# EAGLE design dual_encoder_shield_3v (EAGLE 9.6.2)
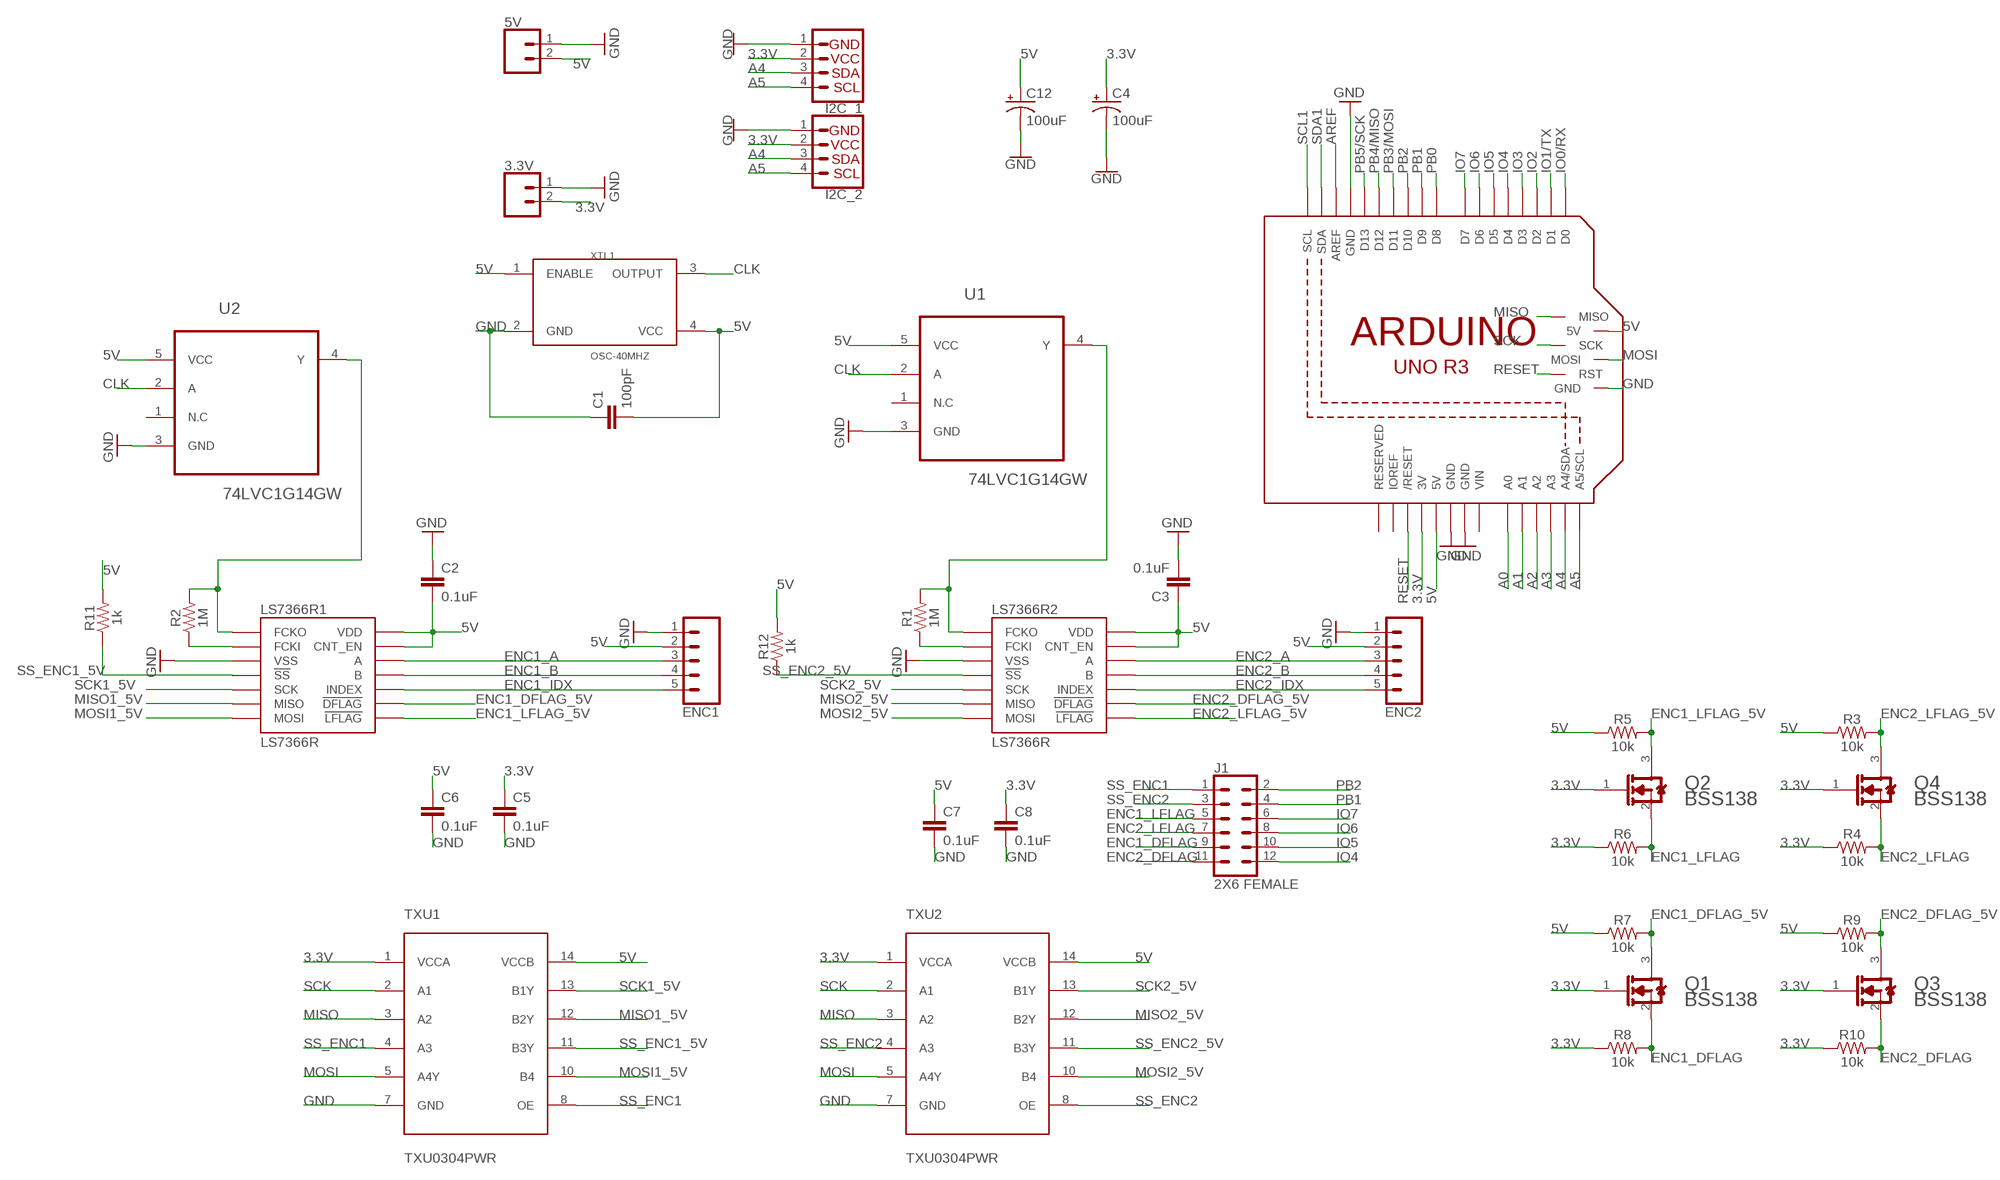
[diagram p0: schematic, sheet 1]

## Parts
3.3V  CONN_02-JST-2MM-SMT  [JST-2-SMD]
5V  CONN_02-JST-2MM-SMT  [JST-2-SMD]
C1  100pF  100PF-0603-50V-5%  [0603]
C2  0.1uF  0.1UF-0603-25V-5%  [0603]
C3  0.1uF  0.1UF-0603-25V-5%  [0603]
C4  100uF  100UF-POLAR-25V-20%(ELEC)  [PANASONIC_D]
C5  0.1uF  0.1UF-0603-25V-5%  [0603]
C6  0.1uF  0.1UF-0603-25V-5%  [0603]
C7  0.1uF  0.1UF-0603-25V-5%  [0603]
C8  0.1uF  0.1UF-0603-25V-5%  [0603]
C12  100uF  100UF-POLAR-25V-20%(ELEC)  [PANASONIC_D]
ENC1  CONN_05  [1X05]
ENC2  CONN_05  [1X05]
I2C_1  QWIIC_CONNECTORJS-1MM  [JST04_1MM_RA]
I2C_2  QWIIC_CONNECTORJS-1MM  [JST04_1MM_RA]
J1  2X6 FEMALE  CONN_06X2PTH_FEMALE  [2X6]
LS7366R1  LS7366R  [SOIC14]
LS7366R2  LS7366R  [SOIC14]
M1  ARDUINO_R3_ICSP  [ARDUINOR3_ICSP]
Q1  ON_SEMI_BSS138ON_SEMI_BSS138_0_0  [ON_SEMI_BSS138_0]
Q2  ON_SEMI_BSS138ON_SEMI_BSS138_0_0  [ON_SEMI_BSS138_0]
Q3  ON_SEMI_BSS138ON_SEMI_BSS138_0_0  [ON_SEMI_BSS138_0]
Q4  ON_SEMI_BSS138ON_SEMI_BSS138_0_0  [ON_SEMI_BSS138_0]
R1  1M  1MOHM-0603-1/4W-5%  [0603]
R2  1M  1MOHM-0603-1/4W-5%  [0603]
R3  10k  10KOHM-0603-1/10W-1%  [0603]
R4  10k  10KOHM-0603-1/10W-1%  [0603]
R5  10k  10KOHM-0603-1/10W-1%  [0603]
R6  10k  10KOHM-0603-1/10W-1%  [0603]
R7  10k  10KOHM-0603-1/10W-1%  [0603]
R8  10k  10KOHM-0603-1/10W-1%  [0603]
R9  10k  10KOHM-0603-1/10W-1%  [0603]
R10  10k  10KOHM-0603-1/10W-1%  [0603]
R11  1k  1KOHM-0603-1/10W-1%  [0603]
R12  1k  1KOHM-0603-1/10W-1%  [0603]
TXU1  TXU0304PWR  [SOP65P640X95-14N]
TXU2  TXU0304PWR  [SOP65P640X95-14N]
U1  74LVC1G14GW  [SOT65P210X110-5N]
U2  74LVC1G14GW  [SOT65P210X110-5N]
XTL1  OSC-40MHZ  [OSC_CB3LV-5I-50M000000]

## Nets
3.3V: 3.3V.2 C4.+ C5.1 C8.1 I2C_1.2 I2C_2.2 M1.3V Q1.1(G) Q2.1(G) Q3.1(G) Q4.1(G) R4.1 R6.1 R8.1 R10.1 TXU1.1(VCCA) TXU2.1(VCCA)
5V: 5V.2 C1.2 C2.2 C3.1 C6.1 C7.1 C12.+ ENC1.2 ENC2.2 LS7366R1.13(CNT_EN) LS7366R1.14(VDD) LS7366R2.13(CNT_EN) LS7366R2.14(VDD) M1.5V M1.5V_ICSP(5V) R3.1 R5.1 R7.1 R9.1 R11.2 R12.2 TXU1.14(VCCB) TXU2.14(VCCB) U1.5(VCC) U2.5(VCC) XTL1.1(ENABLE) XTL1.4(VCC)
A0: M1.A0
A1: M1.A1
A2: M1.A2
A3: M1.A3
A4: I2C_1.3 I2C_2.3 M1.A4(A4/SDA)
A5: I2C_1.4 I2C_2.4 M1.A5(A5/SCL)
AREF: M1.AREF
CLK: U1.2(A) U2.2(A) XTL1.3(OUTPUT)
ENC1_A: ENC1.3 LS7366R1.12(A)
ENC1_B: ENC1.4 LS7366R1.11(B)
ENC1_DFLAG: J1.9 Q1.2(S) R8.2
ENC1_DFLAG_5V: LS7366R1.9(!DFLAG) Q1.3(D) R7.2
ENC1_IDX: ENC1.5 LS7366R1.10(INDEX)
ENC1_LFLAG: J1.5 Q2.2(S) R6.2
ENC1_LFLAG_5V: LS7366R1.8(!LFLAG) Q2.3(D) R5.2
ENC2_A: ENC2.3 LS7366R2.12(A)
ENC2_B: ENC2.4 LS7366R2.11(B)
ENC2_DFLAG: J1.11 Q3.2(S) R10.2
ENC2_DFLAG_5V: LS7366R2.9(!DFLAG) Q3.3(D) R9.2
ENC2_IDX: ENC2.5 LS7366R2.10(INDEX)
ENC2_LFLAG: J1.7 Q4.2(S) R4.2
ENC2_LFLAG_5V: LS7366R2.8(!LFLAG) Q4.3(D) R3.2
GND: 3.3V.1 5V.1 C1.1 C2.1 C3.2 C4.- C5.2 C6.2 C7.2 C8.2 C12.- ENC1.1 ENC2.1 I2C_1.1 I2C_2.1 LS7366R1.3(VSS) LS7366R2.3(VSS) M1.GND M1.GND@1(GND) M1.GND@2(GND) M1.GND@3(GND) TXU1.7(GND) TXU2.7(GND) U1.3(GND) U2.3(GND) XTL1.2(GND)
IO0/RX: M1.D0
IO1/TX: M1.D1
IO2: M1.D2
IO3: M1.D3
IO4: J1.12 M1.D4
IO5: J1.10 M1.D5
IO6: J1.8 M1.D6
IO7: J1.6 M1.D7
MISO: M1.MISO TXU1.3(A2) TXU2.3(A2)
MISO1_5V: LS7366R1.6(MISO) TXU1.12(B2Y)
MISO2_5V: LS7366R2.6(MISO) TXU2.12(B2Y)
MOSI: M1.MOSI TXU1.5(A4Y) TXU2.5(A4Y)
MOSI1_5V: LS7366R1.7(MOSI) TXU1.10(B4)
MOSI2_5V: LS7366R2.7(MOSI) TXU2.10(B4)
N$6: LS7366R1.2(FCKI) R2.1
N$8: LS7366R2.1(FCKO) R1.2 U1.4(Y)
N$9: LS7366R2.2(FCKI) R1.1
N$10: LS7366R1.1(FCKO) R2.2 U2.4(Y)
PB0: M1.D8
PB1: J1.4 M1.D9
PB2: J1.2 M1.D10
PB3/MOSI: M1.D11
PB4/MISO: M1.D12
PB5/SCK: M1.D13
RESET: M1.RESET(/RESET) M1.RESET_ICSP(RST)
SCK: M1.SCK TXU1.2(A1) TXU2.2(A1)
SCK1_5V: LS7366R1.5(SCK) TXU1.13(B1Y)
SCK2_5V: LS7366R2.5(SCK) TXU2.13(B1Y)
SCL1: M1.SCL
SDA1: M1.SDA
SS_ENC1: J1.1 TXU1.4(A3) TXU1.8(OE)
SS_ENC1_5V: LS7366R1.4(!SS) R11.1 TXU1.11(B3Y)
SS_ENC2: J1.3 TXU2.4(A3) TXU2.8(OE)
SS_ENC2_5V: LS7366R2.4(!SS) R12.1 TXU2.11(B3Y)
Unconnected: M1.IOREF M1.RESERVED U1.1(N.C) U2.1(N.C)

## Power pins joined to a net without a drawn wire
VIN: M1.VIN

## Library data of the parts
3.3V 5V = SparkFun-Connectors:CONN_02: Multi connection point. Often used as Generic Header-pin footprint for 0.1 inch spaced/style header connections On any of the 0.1 inch spaced packages, you can populate with these: Break Away Headers - Straight <https://www.sparkfun.com/products/116> (PRT-00116) Break Away Male Headers - Right Angle <https://www.sparkfun.com/products/553> (PRT-00553) Female Headers <https://www.sparkfun.com/products/115> (PRT-00115) Break Away Headers - Machine Pin <https://www.sparkfun.com/products/117> (PRT-00117) Break Away Female Headers - Swiss Machine Pin <https://www.sparkfun.com/products/743> (PRT-00743) For SCREWTERMINALS and SPRING TERMINALS visit here: Screw Terimnals on SparkFun.com <https://www.sparkfun.com/search/results?term=Screw+Terminals> (5mm/3.5mm/2.54mm spacing) This device is also useful as a general connection point to wire up your design to another part of your project. Our various solder wires solder well into these plated through hole pads. Hook-Up Wire - Assortment (Stranded, 22 AWG) <https://www.sparkfun.com/products/11375> (PRT-11375) Hook-Up Wire - Assortment (Solid Core, 22 AWG) <https://www.sparkfun.com/products/11367> (PRT-11367) View the entire wire category on our website here <https://www.sparkfun.com/categories/141> Special notes: Molex polarized connector foot print use with: PRT-08233 with associated crimp pins and housings. 2.54_SCREWTERM for use with PRT-10571. 3.5mm Screw Terminal footprints for PRT-08084 5mm Screw Terminal footprints for use with PRT-08432; PROD_ID: CONN-11443
C1 = SparkFun-Capacitors:100PF: 100pF/0.1nF ceramic capacitors A capacitor is a passive two-terminal electrical component used to store electrical energy temporarily in an electric field.; PROD_ID: CAP-07883
C2 C3 C5-C8 = SparkFun-Capacitors:0.1UF: 0.1µF ceramic capacitors A capacitor is a passive two-terminal electrical component used to store electrical energy temporarily in an electric field.; PROD_ID: CAP-08604
C4 C12 = SparkFun-Capacitors:100UF-POLAR: 100µF polarized capacitors A capacitor is a passive two-terminal electrical component used to store electrical energy temporarily in an electric field.; PROD_ID: CAP-12547
ENC1 ENC2 = SparkFun-Connectors:CONN_05: Multi connection point. Often used as Generic Header-pin footprint for 0.1 inch spaced/style header connections On any of the 0.1 inch spaced packages, you can populate with these: Break Away Headers - Straight <https://www.sparkfun.com/products/116> (PRT-00116) Break Away Male Headers - Right Angle <https://www.sparkfun.com/products/553> (PRT-00553) Female Headers <https://www.sparkfun.com/products/115> (PRT-00115) Break Away Headers - Machine Pin <https://www.sparkfun.com/products/117> (PRT-00117) Break Away Female Headers - Swiss Machine Pin <https://www.sparkfun.com/products/743> (PRT-00743) For SCREWTERMINALS and SPRING TERMINALS visit here: Screw Terimnals on SparkFun.com <https://www.sparkfun.com/search/results?term=Screw+Terminals> (5mm/3.5mm/2.54mm spacing) This device is also useful as a general connection point to wire up your design to another part of your project. Our various solder wires solder well into these plated through hole pads. Hook-Up Wire - Assortment (Stranded, 22 AWG) <https://www.sparkfun.com/products/11375> (PRT-11375) Hook-Up Wire - Assortment (Solid Core, 22 AWG) <https://www.sparkfun.com/products/11367> (PRT-11367) View the entire wire category on our website here <https://www.sparkfun.com/categories/141> Special notes: Molex polarized connector foot print use with SKU : PRT-08231 with associated crimp pins and housings. 1MM SMD Version SKU: PRT-10208
I2C_1 I2C_2 = SparkFun-Connectors:QWIIC_CONNECTOR: SparkFun I2C Standard Qwiic Connector An SMD 1mm pitch JST connector makes it easy and quick (get it? Qwiic?) to connect I2C devices to each other. The Qwiic system <http://www.sparkfun.com/qwiic> enables fast and solderless connection between popular platforms and various sensors and actuators. We carry 200mm <https://www.sparkfun.com/products/14204>, 100mm <https://www.sparkfun.com/products/14205>, 50mm <https://www.sparkfun.com/products/14206>, and breadboard friendly <https://www.sparkfun.com/products/14207> Qwiic cables. We also offer 10 pcs strips <https://www.sparkfun.com/products/14323> the SMD connectors.; PROD_ID: CONN-13694
J1 = SparkFun-Connectors:CONN_06X2: Multi connection point. Often used as Generic Header-pin footprint for 0.1 inch spaced/style header connections On any of the 0.1 inch spaced packages, you can populate with these: Break Away Headers - Straight <https://www.sparkfun.com/products/116> (PRT-00116) Break Away Male Headers - Right Angle <https://www.sparkfun.com/products/553> (PRT-00553) Female Headers <https://www.sparkfun.com/products/115> (PRT-00115) Break Away Headers - Machine Pin <https://www.sparkfun.com/products/117> (PRT-00117) Break Away Female Headers - Swiss Machine Pin <https://www.sparkfun.com/products/743> (PRT-00743); PROD_ID: CONN-12423
LS7366R1 LS7366R2 = LS7366R:LS7366R; AVAILABILITY: Unavailable; MF: LSI; MP: LS7366R; PACKAGE: None; PRICE: None
M1 = adafruit:ARDUINO_R3_ICSP
Q1-Q4 = ON Semi - BSS138:ON_SEMI_BSS138: N-Channel Logic Level Enhancement Mode Field Effect Transistor; CENTROID_NOT_SPECIFIED: No; DATASHEET: https://www.fairchildsemi.com/datasheets/BS/BSS138.pdf; DIGIKEY_DESCRIPTION: TRANS MOSFET N-CH 50V 220MA SOT-23; DIGIKEY_PART_NUMBER: BSS138CT-ND; LEAD_FREE: yes; MF: ON Semi; MFG_PACKAGE_IDENT: BSS138; MFG_PACKAGE_IDENT_DATE: 0; MFG_PACKAGE_IDENT_REV: 0; MOUSER_DESCRIPTION: MOSFET SOT-23 N-CH LOGIC; MOUSER_PART_NUMBER: 512-BSS138; MPN: BSS138; PACKAGE: SOT23; PREFIX: Q; ROHS: yes; TEMPERATURE_RANGE_HIGH: +150°C; TEMPERATURE_RANGE_LOW: -55°C
R1 R2 = SparkFun-Resistors:1MOHM: 1MΩ resistor A resistor is a passive two-terminal electrical component that implements electrical resistance as a circuit element. Resistors act to reduce current flow, and, at the same time, act to lower voltage levels within circuits. - Wikipedia; PROD_ID: RES-07868
R3-R10 = SparkFun-Resistors:10KOHM: 10kΩ resistor A resistor is a passive two-terminal electrical component that implements electrical resistance as a circuit element. Resistors act to reduce current flow, and, at the same time, act to lower voltage levels within circuits. - Wikipedia; PROD_ID: RES-00824
R11 R12 = SparkFun-Resistors:1KOHM: 1kΩ resistor A resistor is a passive two-terminal electrical component that implements electrical resistance as a circuit element. Resistors act to reduce current flow, and, at the same time, act to lower voltage levels within circuits. - Wikipedia; PROD_ID: RES-07856
TXU1 TXU2 = steveo:TXU0304PWR
U1 U2 = 74LVC1G14GW:74LVC1G14GW: Single Schmitt-trigger inverter; AVAILABILITY: Unavailable; DESCRIPTION: IC MOS 74LVC1G14/SO/74LVC1G14GW PHILIPS RoHS LVC SOt23; MF: NXP Semiconductors; MP: 74LVC1G14GW; PACKAGE: TSSOP-5 NXP Semiconductors; PRICE: 214.47 USD
XTL1 = steveo:OSC-40MHZ

## Board
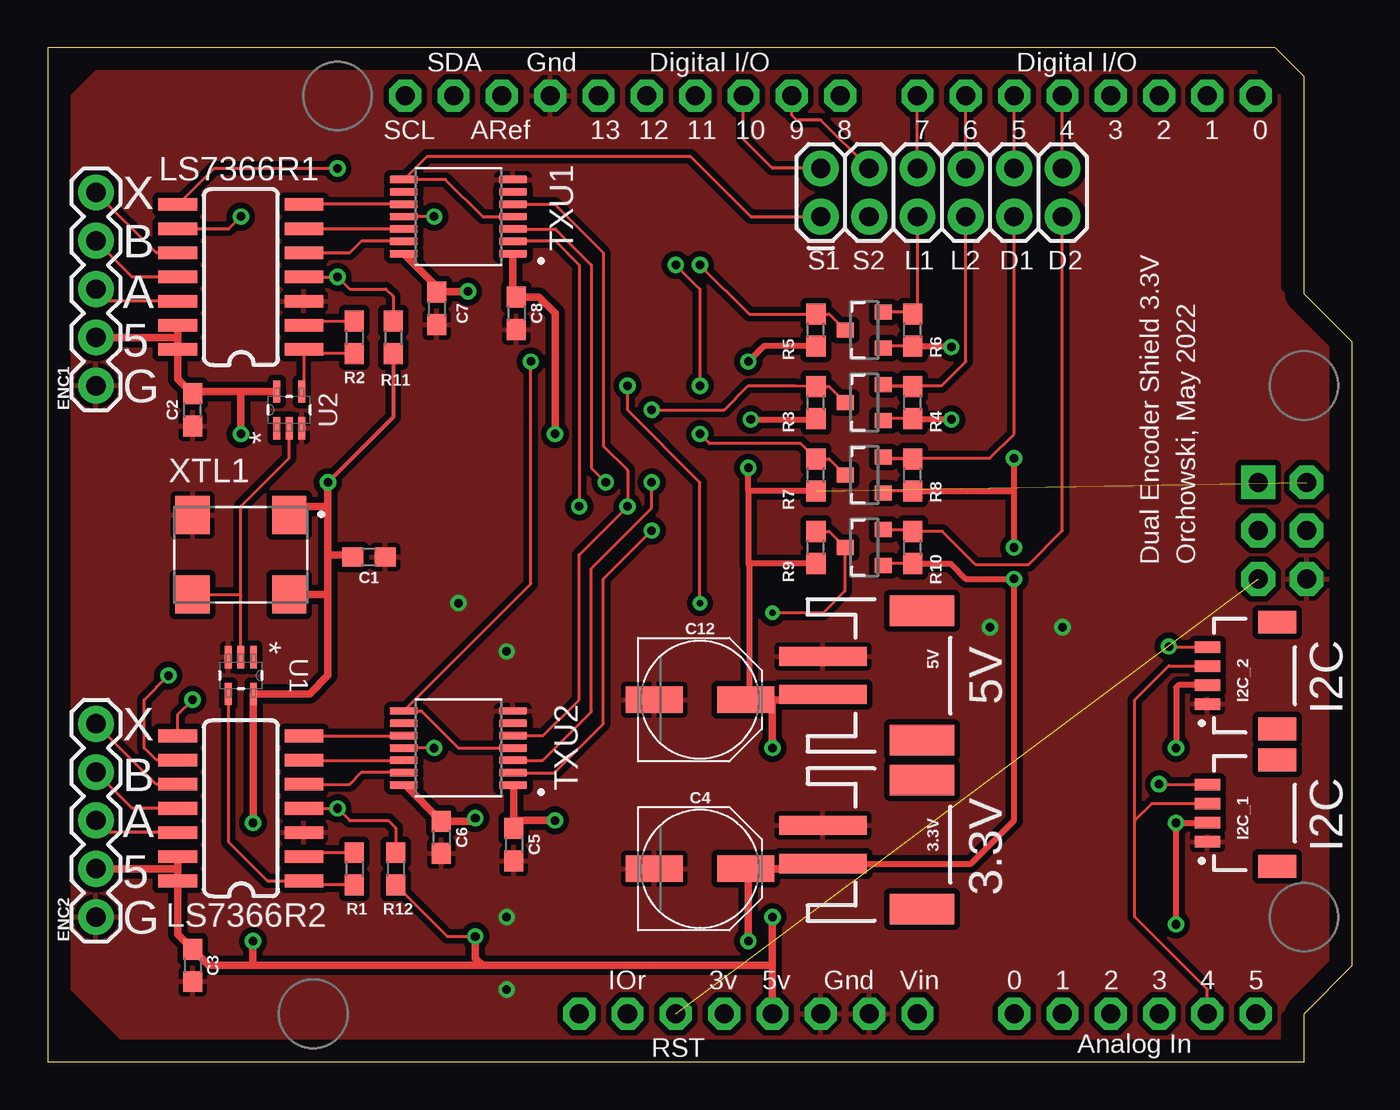
[diagram p1: board, top side]
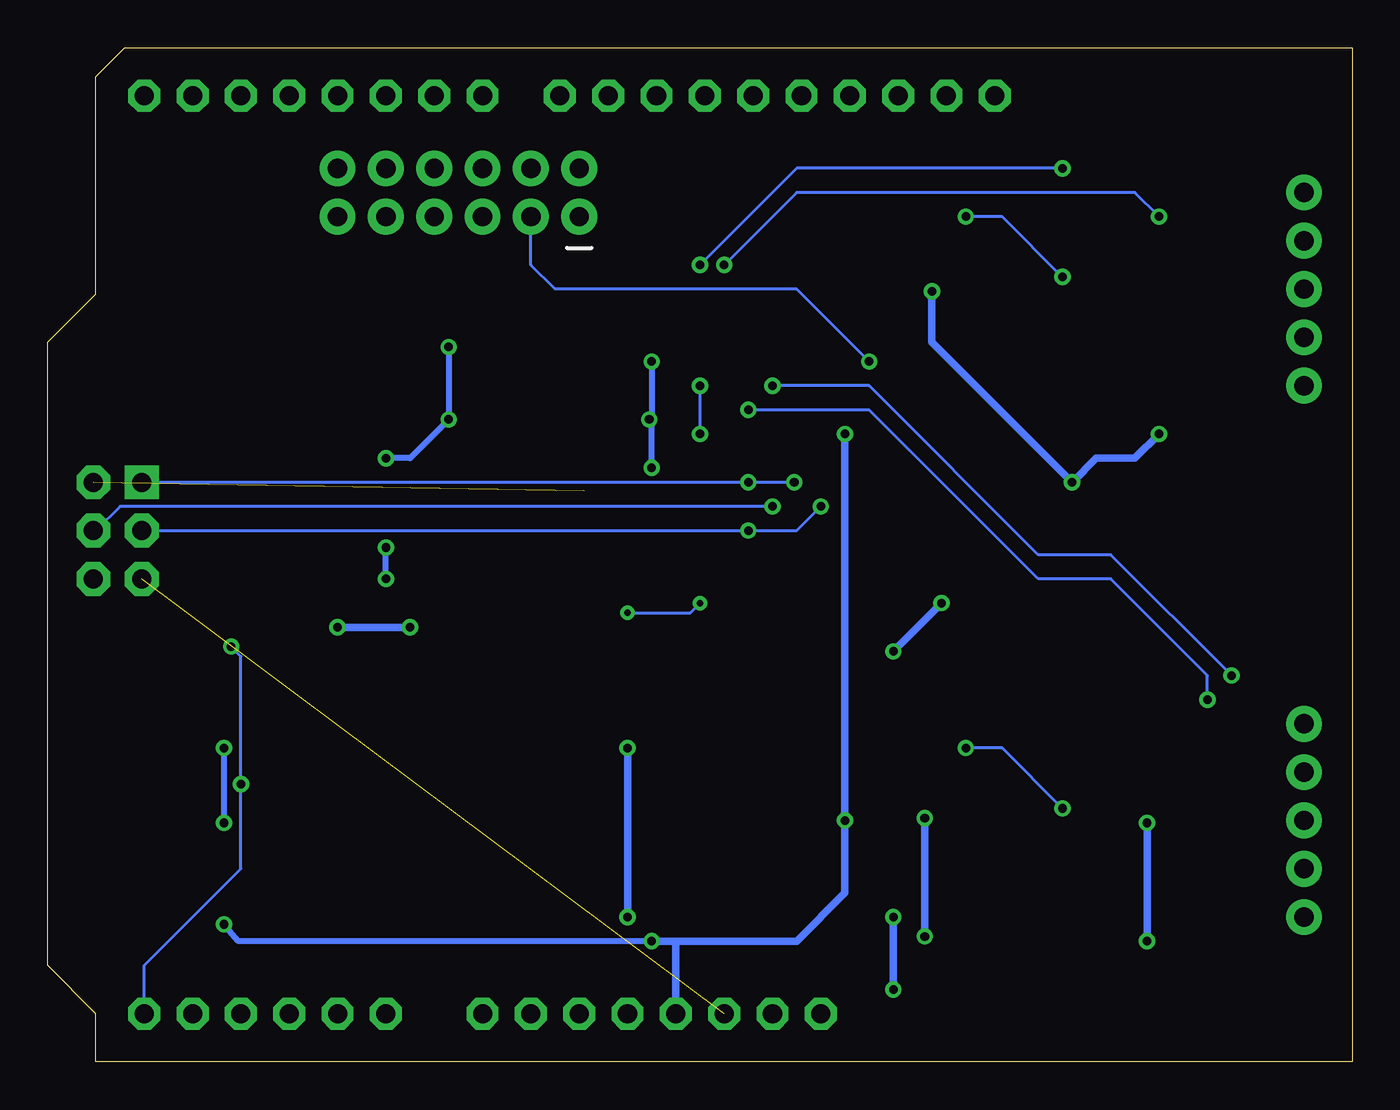
[diagram p2: board, bottom side, seen from below]

Size 68.58 x 53.34 mm. Coordinates in mm from the lower left corner, seen from the top.
Copper layers (1*16): Top 0.035mm / dielectric 1.5mm / Bottom 0.035mm
Design rules "default": minimum track width 6mil, minimum drill 0.35mm, track to track 6mil, track to pad 6mil, pad to pad 6mil, via to via 6mil, smd to smd 6mil, copper to edge 40mil, drill to drill 6mil, minimum pad ring 10mil, minimum via ring 8mil, stop-mask expansion 4mil, vias tented up to drill 0mil, thermal gap 10mil

### Footprints (pad centres in the part's own frame; a part is rotated, then mirrored left to right if it is on the bottom)
JST-2-SMD = smd 1 x 4.6: 1 -1,-3.7; 2 1,-3.7 | smd 1.6 x 3.4: NC1 -3.4,1.5; NC2 3.4,1.5
0603 = smd 1.1 x 1: 1 -0.85,0; 2 0.85,0
PANASONIC_D = smd 3 x 1.4: + 2.4,0; - -2.4,0
1X05 = drill 1.016 pad 1.88: 1 0,0; 2 2.54,0; 3 5.08,0; 4 7.62,0; 5 10.16,0
JST04_1MM_RA = smd 0.6 x 1.35: 1 -1.5,0; 2 -0.5,0; 3 0.5,0; 4 1.5,0 | smd 1.2 x 2: NC1 2.8,-3.675; NC2 -2.8,-3.675
2X6 = drill 1.016 pad 1.88: 1 0,0; 2 0,2.54; 3 2.54,0; 4 2.54,2.54; 5 5.08,0; 6 5.08,2.54; 7 7.62,0; 8 7.62,2.54; 9 10.16,0; 10 10.16,2.54; 11 12.7,0; 12 12.7,2.54
SOIC14 = smd 2.032 x 0.66: 1 -3.315,4.445; 2 -3.315,3.175; 3 -3.315,1.905; 4 -3.315,0.635; 5 -3.315,-0.635; 6 -3.315,-1.905; 7 -3.315,-3.175; 8 3.315,-3.175; 9 3.315,-1.905; 10 3.315,-0.635; 11 3.315,0.635; 12 3.315,1.905; 13 3.315,3.175; 14 3.315,4.445
ARDUINOR3_ICSP = drill 1 pad 1.676 octagon: 3V 35.56,2.54; 5V 38.1,2.54; A0 50.8,2.54; A1 53.34,2.54; A2 55.88,2.54; A3 58.42,2.54; A4 60.96,2.54; A5 63.5,2.54; AREF 23.876,50.8; D0 63.5,50.8; D1 60.96,50.8; D2 58.42,50.8; D3 55.88,50.8; D4 53.34,50.8; D5 50.8,50.8; D6 48.26,50.8; D7 45.72,50.8; D8 41.656,50.8; D9 39.116,50.8; D10 36.576,50.8; D11 34.036,50.8; D12 31.496,50.8; D13 28.956,50.8; GND 26.416,50.8; GND@1 43.18,2.54; GND@2 40.64,2.54; IOREF 30.48,2.54; RESERVED 27.94,2.54; RESET 33.02,2.54; SCL 18.796,50.8; SDA 21.336,50.8; VIN 45.72,2.54 | drill 1 pad 1.778 octagon: 5V_ICSP 66.167,30.48; GND@3 66.167,25.4; MOSI 66.167,27.94; RESET_ICSP 63.627,25.4; SCK 63.627,27.94 | drill 1 pad 1.778 square: MISO 63.627,30.48
ON_SEMI_BSS138_0 = smd 0.8 x 0.9: 1 -0.95,-1; 2 0.95,-1; 3 0,1
SOP65P640X95-14N = smd 1.47 x 0.38: 1 -2.87,1.95; 2 -2.87,1.3; 3 -2.87,0.65; 4 -2.87,0; 5 -2.87,-0.65; 6 -2.87,-1.3; 7 -2.87,-1.95; 8 2.87,-1.95; 9 2.87,-1.3; 10 2.87,-0.65; 11 2.87,0; 12 2.87,0.65; 13 2.87,1.3; 14 2.87,1.95
SOT65P210X110-5N = smd 1.168 x 0.356: 1 -0.965,0.66; 2 -0.965,0; 3 -0.965,-0.66; 4 0.965,-0.66; 5 0.965,0.66
OSC_CB3LV-5I-50M000000 = smd 1.8 x 2: 1 -2.54,-2.1; 2 2.54,-2.1; 3 2.54,2.1; 4 -2.54,2.1

### Placement (x,y rotation side)
3.3V  44.45,11.43 270 top
5V  44.45,20.32 270 top
C1  16.89,26.54 180 top
C2  7.62,34.29 90 top
C3  7.62,5.08 270 top
C4  34.29,10.16 0 top
C5  24.51,11.43 270 top
C6  20.7,11.81 270 top
C7  20.45,39.62 270 top
C8  24.64,39.37 270 top
C12  34.29,19.05 0 top
ENC1  2.54,35.56 90 top
ENC2  2.54,7.62 90 top
I2C_1  60.96,13.08 90 top
I2C_2  60.96,20.32 90 top
J1  40.64,44.45 0 top
LS7366R1  10.16,41.91 180 top
LS7366R2  10.16,13.97 180 top
M1  0,0 0 top
Q1  42.93,30.86 90 top
Q2  42.93,38.48 90 top
Q3  42.93,27.05 90 top
Q4  42.93,34.67 90 top
R1  16.13,10.16 270 top
R2  16.13,38.1 270 top
R3  40.39,34.67 90 top
R4  45.47,34.67 90 top
R5  40.39,38.48 90 top
R6  45.47,38.48 90 top
R7  40.39,30.86 90 top
R8  45.47,30.86 90 top
R9  40.39,27.05 90 top
R10  45.47,27.05 90 top
R11  18.16,38.1 270 top
R12  18.29,10.16 270 top
TXU1  21.59,44.45 180 top
TXU2  21.59,16.51 180 top
U1  10.16,20.32 270 top
U2  12.7,34.29 90 top
XTL1  10.16,26.67 180 top

### Tracks (layer width: path | path; a pad name or v marks a point on that pad's centre or on a via)
3.3V  (via drill 0.45)
  Top 0.152: R6.1 44.03,37.63 Q2.1 | R4.1 44.03,33.82 Q4.1 | R8.1 44.03,30.01 Q1.1 | R10.1 44.03,26.2 Q3.1
  Top 0.305: I2C_1.2 v59.31,12.57 v59.31,7.24 | 3.3V.2 48.53,10.43 50.8,12.7 v50.8,25.4 48.26,25.4 47.46,26.2 R10.1 | I2C_2.2 59.44,19.82 59.31,19.68 v59.31,16.51 | R6.1 47.46,37.63 v47.5,37.59 | v47.5,33.78 45.51,33.78 R4.1 | v50.8,27.05 50.8,29.97 | 50.8,29.97 v50.8,31.75 | R8.1 50.76,30.01 50.8,29.97
  Top 0.406: C5.1 24.51,12.7 | 24.51,12.7 24.51,14.51 TXU2.1 | TXU1.1 24.46,40.4 C8.1 25.82,40.22 26.67,39.37 v26.67,33.02 | 3.3V.2 40.48,10.16 C4.+ 36.83,10.02 v36.83,6.35 | v26.67,12.7 24.51,12.7
  Bottom 0.305: v36.83,6.35 58.55,6.35 v59.31,7.24 | v59.31,16.51 v59.31,12.57 | v47.5,37.59 v47.5,33.78 49.53,31.75 v50.8,31.75 | v50.8,25.4 v50.8,27.05
  Bottom 0.406: M1.3V 35.56,6.35 | 35.56,6.35 v36.83,6.35 | 35.56,6.35 29.21,6.35 26.67,8.89 v26.67,12.7 v26.67,33.02
5V  (via drill 0.45)  (1 unrouted)
  Top 0.152: R12.2 20.99,6.6 v22.48,6.6
  Top 0.203: R11.2 18.16,33.91 14.7,30.45
  Top 0.305: R5.1 37.63,37.63 v36.83,36.83 | v36.96,33.78 40.35,33.78 R3.1 | R9.1 36.87,26.2 | 36.87,26.2 36.83,26.16 | R7.1 36.87,30.01 | 36.87,30.01 36.83,29.97 36.83,26.24 36.87,26.2 | C12.+ 36.87,19.23 36.87,26.2 | 36.87,30.01 36.83,30.05 v36.83,31.24
  Top 0.406: LS7366R1.13 6.84,38.1 | 6.84,38.1 LS7366R1.14 6.84,35.91 C2.2 7.74,35.26 10.16,35.26 | LS7366R2.13 6.84,10.16 | 6.84,10.16 LS7366R2.14 6.84,6.71 C3.1 8.47,5.08 10.79,5.08 | ENC2.2 6.84,10.16 | ENC1.2 6.84,38.1 | 10.16,35.26 U2.5 | v14.73,30.48 14.7,30.45 14.73,30.42 14.73,29.21 | v10.16,33.02 10.16,35.26 | 10.79,5.08 22.86,5.08 | 22.86,5.08 38.1,5.08 | 38.1,5.08 M1.5V | v10.79,12.57 10.82,12.6 U1.5 13.77,19.36 14.73,20.32 14.73,24.64 | v10.79,6.35 10.79,5.08 | C12.+ 38.1,19.05 | 38.1,19.05 40.48,19.05 5V.2 | 38.1,5.08 v38.1,7.62 | v38.1,16.51 38.1,19.05 | 22.86,5.08 22.48,5.46 v22.48,6.6 | v22.48,12.83 22.31,12.66 C6.1 18.8,14.56 TXU2.14 | v22.1,40.51 20.49,40.51 C7.1 20.45,40.77 TXU1.14 | 14.73,24.64 14.73,26.67 | 14.73,26.67 14.73,29.21 | 14.73,26.67 15.91,26.67 C1.2 | XTL1.4 14.66,24.57 14.73,24.64 | XTL1.1 13.14,29.21 14.73,29.21
  Bottom 0.305: v36.83,36.83 36.83,33.91 v36.96,33.78 36.83,33.66 v36.83,31.24
  Bottom 0.406: v10.16,33.02 11.43,31.75 13.46,31.75 v14.73,30.48 22.1,37.85 v22.1,40.51 | v10.79,12.57 v10.79,6.35 | v38.1,7.62 v38.1,16.51 | v22.48,6.6 v22.48,12.83
A4
  Top 0.152: 57.15,12.7 57.15,7.62 60.96,3.81 M1.A4 | 57.15,12.7 57.15,19.05 58.93,20.83 58.94,20.82 I2C_2.3 | I2C_1.3 58.03,13.58 57.15,12.7
A5  (via drill 0.45)
  Top 0.152: v58.93,21.84 58.95,21.82 I2C_2.4 | v58.42,14.61 60.94,14.61 I2C_1.4
  Bottom 0.152: M1.A5 63.5,5.08 58.42,10.16 v58.42,14.61 58.42,21.34 v58.93,21.84
CLK
  Top 0.152: U1.2 10.16,24.51 | 10.16,24.51 10.16,29.21 12.7,31.75 U2.2 | XTL1.3 10.1,24.57 10.16,24.51
ENC1_A
  Top 0.152: LS7366R1.12 3.17,40.01 ENC1.3
ENC1_B
  Top 0.152: LS7366R1.11 4.45,41.27 ENC1.4
ENC1_DFLAG
  Top 0.152: Q1.2 44.03,31.71 R8.2 44.23,31.75 49.53,31.75 50.8,33.02 J1.9
ENC1_DFLAG_5V  (via drill 0.45)
  Top 0.152: LS7366R1.9 9.53,43.81 v10.16,44.45 | Q1.3 41.08,31.71 R7.2 39.59,32.51 34.8,32.51 v34.29,33.02 | v33.02,41.91 34.29,40.64 v34.29,35.56
  Bottom 0.152: v10.16,44.45 11.43,45.72 29.21,45.72 v33.02,41.91 | v34.29,35.56 v34.29,33.02
ENC1_IDX
  Top 0.152: LS7366R1.10 5.71,42.55 ENC1.5
ENC1_LFLAG
  Top 0.152: Q2.2 45.37,39.43 R6.2 45.72,39.59 J1.5
ENC1_LFLAG_5V  (via drill 0.45)
  Top 0.152: LS7366R1.8 8.75,46.99 v15.24,46.99 | Q2.3 41.08,39.33 R5.2 36.87,39.33 v34.29,41.91
  Bottom 0.152: v15.24,46.99 29.21,46.99 v34.29,41.91
ENC2_A
  Top 0.152: LS7366R2.12 3.17,12.06 ENC2.3
ENC2_B
  Top 0.152: LS7366R2.11 4.45,13.34 ENC2.4
ENC2_DFLAG
  Top 0.152: J1.11 53.34,27.94 51.56,26.16 48.77,26.16 47.03,27.9 R10.2 45.37,28 Q3.2
ENC2_DFLAG_5V  (via drill 0.35, 0.45)
  Top 0.152: LS7366R2.9 5.71,15.88 5.08,16.51 5.08,19.05 v6.35,20.32 | R9.2 41.08,27.9 Q3.3 41.91,27.04 41.91,24.77 40.77,23.62 v38.1,23.62 | v30.48,35.56 30.48,34.29 34.29,30.48 v34.29,24.13
  Bottom 0.152: v6.35,20.32 12.7,26.67 16.51,26.67 25.4,35.56 v30.48,35.56 | v38.1,23.62 34.8,23.62 v34.29,24.13
ENC2_IDX
  Top 0.152: LS7366R2.10 5.71,14.61 ENC2.5
ENC2_LFLAG
  Top 0.152: Q4.2 44.03,35.52 R4.2 44.23,35.56 46.99,35.56 48.26,36.83 J1.7
ENC2_LFLAG_5V  (via drill 0.45)
  Top 0.152: LS7366R2.8 6.84,18.27 v7.62,19.05 | R3.2 40.64,35.52 | 40.64,35.52 41.08,35.52 Q4.3 | v31.75,34.29 35.56,34.29 36.83,35.56 39.33,35.56 40.64,35.52
  Bottom 0.152: v7.62,19.05 7.62,20.32 12.7,25.4 16.51,25.4 25.4,34.29 v31.75,34.29
GND  (via drill 0.45)
  Bottom 0.406: v24.13,7.62 v24.13,3.81 | v49.53,22.86 v53.34,22.86 | v24.13,21.59 v21.59,24.13
  pour Top (isolate 0.305): 2.54,52.07 1.27,50.8 1.27,3.81 3.81,1.27 64.77,1.27 64.77,2.54 67.31,5.08 67.31,38.1 64.77,40.64 64.77,50.8 63.5,52.07
IO4
  Top 0.152: J1.12 M1.D4
IO5
  Top 0.152: J1.10 M1.D5
IO6
  Top 0.152: J1.8 M1.D6
IO7
  Top 0.152: J1.6 M1.D7
MISO  (via drill 0.45)
  Top 0.152: TXU1.3 26.68,43.8 28.57,41.91 28.57,31.24 v29.34,30.48 | TXU2.3 26.02,15.86 28.57,18.41 28.57,25.96 31.75,29.13 v31.75,30.48
  Bottom 0.152: v29.34,30.48 v31.75,30.48 M1.MISO
MISO1_5V
  Top 0.152: LS7366R1.6 18.7,43.81 TXU1.12
MISO2_5V
  Top 0.152: LS7366R2.6 13.49,15.86 TXU2.12
MOSI  (via drill 0.45)
  Top 0.152: TXU1.5 26.66,45.1 29.21,42.55 29.21,32.38 30.48,31.11 v30.48,29.21 27.94,26.67 27.94,19.05 26.05,17.16 TXU2.5
  Bottom 0.152: M1.MOSI 66.04,27.94 64.77,29.21 v30.48,29.21
MOSI1_5V
  Top 0.152: TXU1.10 13.49,45.1 LS7366R1.7
MOSI2_5V
  Top 0.152: LS7366R2.7 18.7,17.14 TXU2.10
N$6
  Top 0.152: LS7366R1.2 13.69,38.95 R2.1
N$8
  Top 0.152: R1.2 13.69,9.31 LS7366R2.1 11.56,9.53 9.5,11.58 U1.4
N$9
  Top 0.152: LS7366R2.2 13.69,11.01 R1.1
N$10
  Top 0.152: R2.2 13.69,37.25 LS7366R1.1 13.47,35.37 U2.4
PB1
  Top 0.152: M1.D9 39.12,49.78 39.37,49.53 40.64,49.53 J1.4
PB2
  Top 0.152: J1.2 38.1,46.99 36.58,48.51 M1.D10
RESET  (1 unrouted)
SCK  (via drill 0.45)
  Top 0.152: TXU1.2 24.49,43.18 26.67,43.18 27.94,41.91 v27.94,29.21 | TXU2.2 26.64,15.21 29.21,17.78 29.21,25.4 v31.75,27.94
  Bottom 0.152: v27.94,29.21 29.21,27.94 v31.75,27.94 M1.SCK
SCK1_5V
  Top 0.152: LS7366R1.5 15.88,42.55 16.51,43.18 18.69,43.18 TXU1.13
SCK2_5V
  Top 0.152: LS7366R2.5 15.88,14.61 16.51,15.24 18.69,15.24 TXU2.13
SS_ENC1
  Top 0.152: TXU1.4 22.86,44.45 20.91,46.4 TXU1.8 19.95,47.62 33.78,47.62 36.96,44.45 J1.1
SS_ENC1_5V  (via drill 0.45)
  Top 0.152: LS7366R1.4 v15.24,41.27 15.88,40.64 17.78,40.64 18.16,40.26 R11.1 | v20.32,44.45 TXU1.11
  Bottom 0.152: v15.24,41.27 18.41,44.45 v20.32,44.45
SS_ENC2  (via drill 0.45)
  Top 0.152: TXU2.4 21.59,16.51 19.64,18.46 TXU2.8 25.4,25.14 v25.4,36.83
  Bottom 0.152: v25.4,36.83 29.21,40.64 41.91,40.64 43.18,41.91 J1.3
SS_ENC2_5V  (via drill 0.45)
  Top 0.152: LS7366R2.4 v15.24,13.34 15.88,12.7 17.91,12.7 18.29,12.32 R12.1 | v20.32,16.51 TXU2.11
  Bottom 0.152: v15.24,13.34 18.41,16.51 v20.32,16.51

### Text on the board
tPlace: X | S1 | L1 | L2 | B | S2 | D1 | D2 | A | 5 | G | Dual Encoder Shield 3.3V | Orchowski, May 2022 | 5V | I2C | X | B | A | I2C | 5 | 3.3V | G